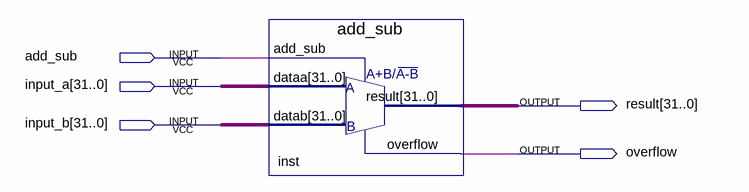
[diagram p0: schematic sheet]
// Quartus schematic adder_sub.bdf as structural Verilog: 1 symbols, 5 pins
module adder_sub (
  input  add_sub,
  input  [31:0] input_a,
  input  [31:0] input_b,
  output [31:0] result,
  output overflow
);

  add_sub inst (.add_sub(add_sub), .dataa(input_a), .datab(input_b), .result(result), .overflow(overflow));
endmodule
